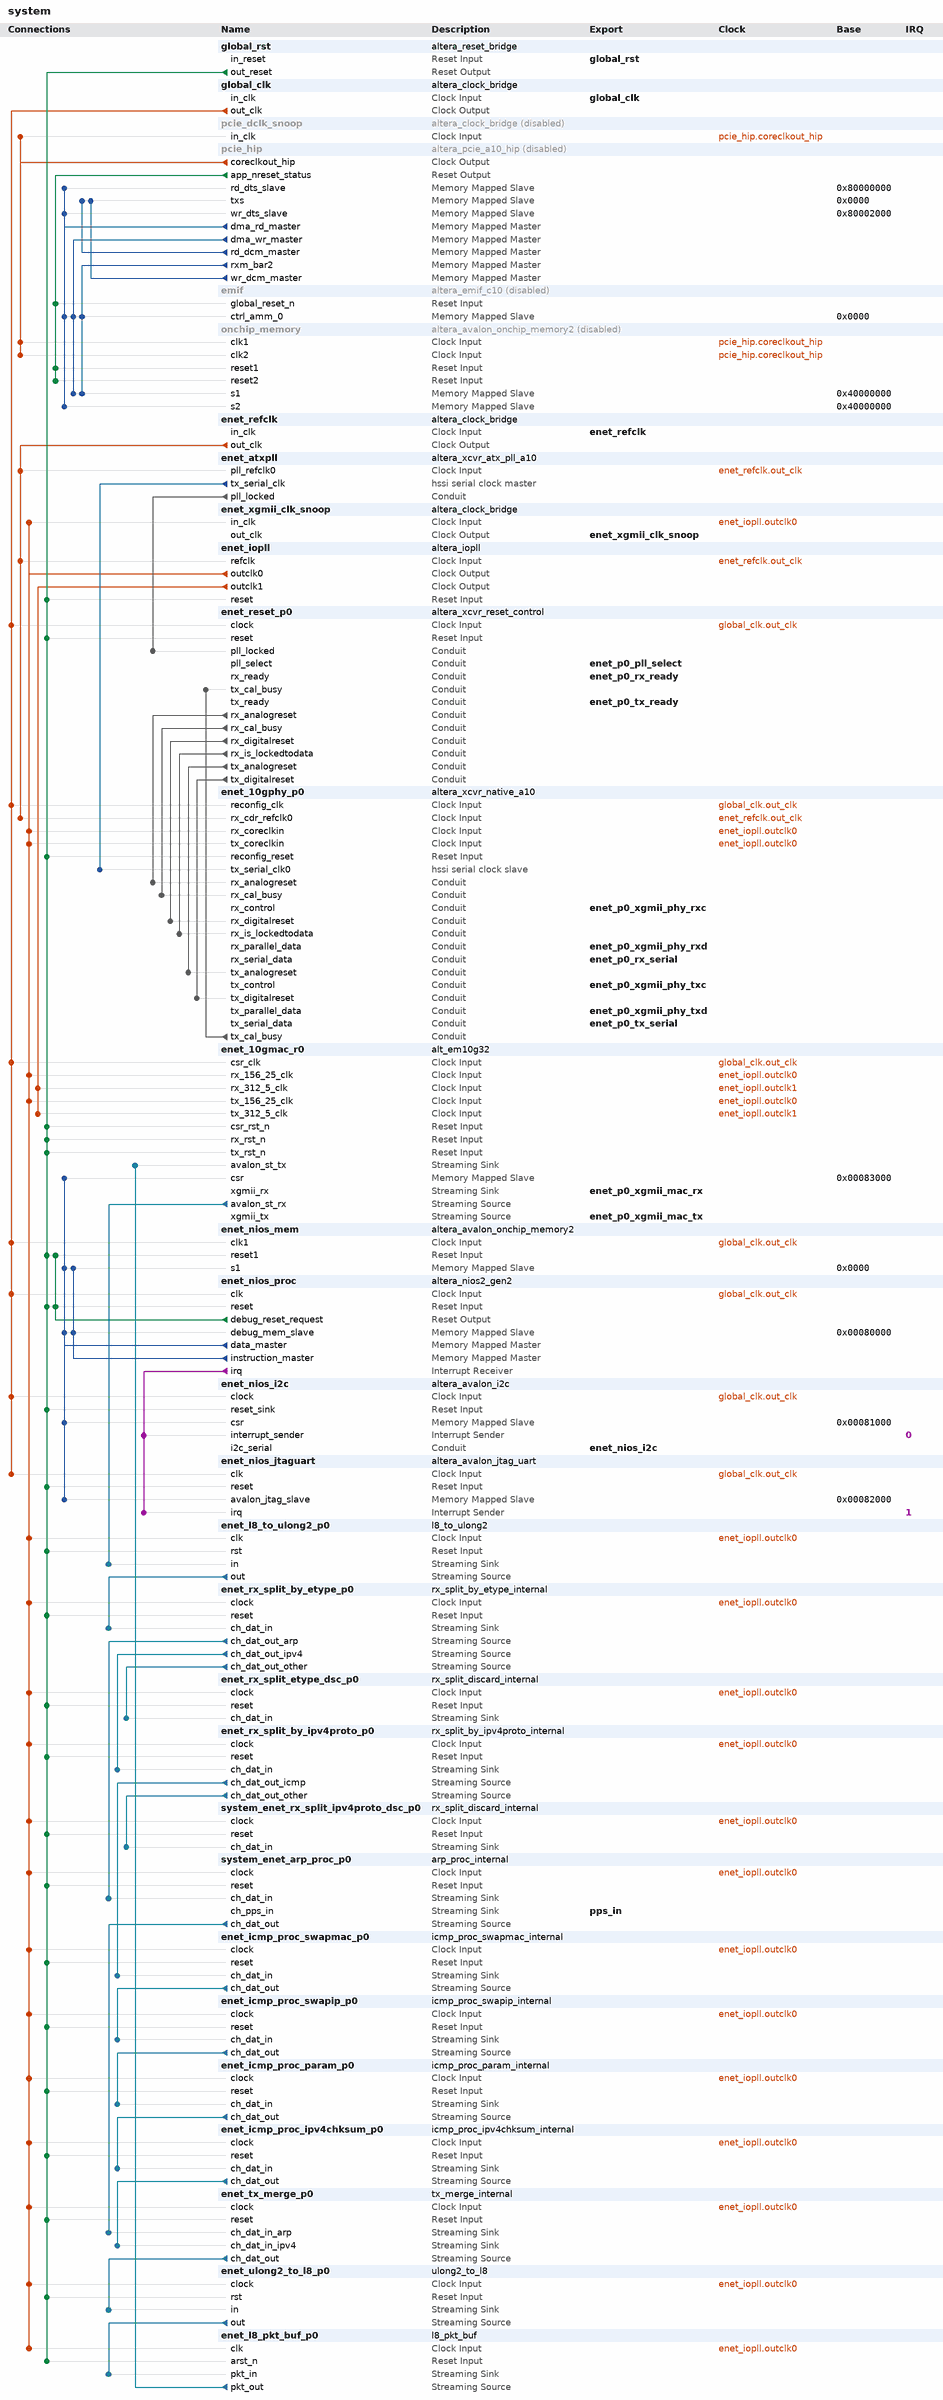
[diagram p0: system contents]
# Platform Designer (Qsys) system system, Cyclone 10 GX 10CX220YF780E5G
# Parameters at their usual value, and those the tool derives, are not listed.
package require -exact qsys 1.0
create_system system
set_project_property DEVICE_FAMILY {Cyclone 10 GX}
set_project_property DEVICE 10CX220YF780E5G

add_component global_rst ip/system_global_rst.ip altera_reset_bridge global_rst 19.2.0

add_component global_clk ip/system_global_clk.ip altera_clock_bridge global_clk 19.2.0

add_component pcie_dclk_snoop ip/system_pcie_dclk_snoop.ip altera_clock_bridge pcie_dclk_snoop 19.2.0
set_instance_property pcie_dclk_snoop ENABLED false

add_component pcie_hip ip/system_pcie_hip.ip altera_pcie_a10_hip pcie_hip 19.1
set_instance_property pcie_hip ENABLED false

add_component emif ip/system_emif.ip altera_emif_c10 emif 19.1.0
set_instance_property emif ENABLED false

add_component onchip_memory ip/system_onchip_memory.ip altera_avalon_onchip_memory2 onchip_memory 19.2.0
set_instance_property onchip_memory ENABLED false

add_component enet_refclk ip/system_enet_refclk.ip altera_clock_bridge enet_refclk 19.2.0

add_component enet_atxpll ip/system_enet_atxpll.ip altera_xcvr_atx_pll_a10 enet_atxpll 19.1

add_component enet_xgmii_clk_snoop ip/system_enet_xgmii_clk_snoop.ip altera_clock_bridge enet_xgmii_clk_snoop 19.2.0

add_component enet_iopll ip/system_enet_iopll.ip altera_iopll enet_iopll 19.3.0

add_component enet_reset_p0 ip/system_enet_reset_p0.ip altera_xcvr_reset_control enet_reset_p0 19.1

add_component enet_10gphy_p0 ip/system_enet_10gphy_p0.ip altera_xcvr_native_a10 enet_10gphy_p0 19.1

add_component enet_10gmac_r0 ip/system_enet_10gmac_p0.ip alt_em10g32 enet_10gmac_r0 19.3.0

add_component enet_nios_mem ip/system_enet_nios_mem.ip altera_avalon_onchip_memory2 enet_nios_mem 19.2.0

add_component enet_nios_proc ip/system_enet_nios_proc.ip altera_nios2_gen2 enet_nios_proc 19.1.0

add_component enet_nios_i2c ip/system_enet_nios_i2c.ip altera_avalon_i2c enet_nios_i2c 19.2.0

add_component enet_nios_jtaguart ip/system_enet_nios_jtaguart.ip altera_avalon_jtag_uart enet_nios_jtaguart 19.1.0

add_component enet_l8_to_ulong2_p0 ip/system_enet_l8_to_ulong2_p0.ip l8_to_ulong2 enet_l8_to_ulong2_p0 20.1

add_component enet_rx_split_by_etype_p0 ip/system_enet_rx_split_by_etype_p0.ip rx_split_by_etype_internal enet_rx_split_by_etype_p0 1.0

add_component enet_rx_split_etype_dsc_p0 ip/system_enet_rx_split_etype_dsc_p0.ip rx_split_discard_internal enet_rx_split_etype_dsc_p0 1.0

add_component enet_rx_split_by_ipv4proto_p0 ip/system_enet_rx_split_by_ipv4proto_p0.ip rx_split_by_ipv4proto_internal enet_rx_split_by_ipv4proto_p0 1.0

add_component system_enet_rx_split_ipv4proto_dsc_p0 ip/system_enet_rx_split_ipv4proto_dsc_p0.ip rx_split_discard_internal system_enet_rx_split_ipv4proto_dsc_p0 1.0

add_component system_enet_arp_proc_p0 ip/system_enet_arp_proc_p0.ip arp_proc_internal system_enet_arp_proc_p0 1.0

add_component enet_icmp_proc_swapmac_p0 ip/system_enet_icmp_proc_swapmac_p0.ip icmp_proc_swapmac_internal enet_icmp_proc_swapmac_p0 1.0

add_component enet_icmp_proc_swapip_p0 ip/system_enet_icmp_proc_swapip_p0.ip icmp_proc_swapip_internal enet_icmp_proc_swapip_p0 1.0

add_component enet_icmp_proc_param_p0 ip/system_enet_icmp_proc_param_p0.ip icmp_proc_param_internal enet_icmp_proc_param_p0 1.0

add_component enet_icmp_proc_ipv4chksum_p0 ip/system_enet_icmp_proc_ipv4chksum_p0.ip icmp_proc_ipv4chksum_internal enet_icmp_proc_ipv4chksum_p0 1.0

add_component enet_tx_merge_p0 ip/system_enet_tx_merge_p0.ip tx_merge_internal enet_tx_merge_p0 1.0

add_component enet_ulong2_to_l8_p0 ip/system_enet_ulong2_to_l8_p0.ip ulong2_to_l8 enet_ulong2_to_l8_p0 20.1

add_component enet_l8_pkt_buf_p0 ip/system_enet_l8_pkt_buf_p0.ip l8_pkt_buf enet_l8_pkt_buf_p0 1.0

# connections
add_connection enet_iopll.outclk0 enet_10gmac_r0.rx_156_25_clk clock
add_connection enet_iopll.outclk0 enet_10gmac_r0.tx_156_25_clk clock
add_connection enet_iopll.outclk0 enet_10gphy_p0.rx_coreclkin clock
add_connection enet_iopll.outclk0 enet_10gphy_p0.tx_coreclkin clock
add_connection enet_iopll.outclk0 enet_icmp_proc_ipv4chksum_p0.clock clock
add_connection enet_iopll.outclk0 enet_icmp_proc_param_p0.clock clock
add_connection enet_iopll.outclk0 enet_icmp_proc_swapip_p0.clock clock
add_connection enet_iopll.outclk0 enet_icmp_proc_swapmac_p0.clock clock
add_connection enet_iopll.outclk0 enet_l8_pkt_buf_p0.clk clock
add_connection enet_iopll.outclk0 enet_l8_to_ulong2_p0.clk clock
add_connection enet_iopll.outclk0 enet_rx_split_by_etype_p0.clock clock
add_connection enet_iopll.outclk0 enet_rx_split_by_ipv4proto_p0.clock clock
add_connection enet_iopll.outclk0 enet_rx_split_etype_dsc_p0.clock clock
add_connection enet_iopll.outclk0 enet_tx_merge_p0.clock clock
add_connection enet_iopll.outclk0 enet_ulong2_to_l8_p0.clock clock
add_connection enet_iopll.outclk0 enet_xgmii_clk_snoop.in_clk clock
add_connection enet_iopll.outclk0 system_enet_arp_proc_p0.clock clock
add_connection enet_iopll.outclk0 system_enet_rx_split_ipv4proto_dsc_p0.clock clock
add_connection enet_iopll.outclk1 enet_10gmac_r0.rx_312_5_clk clock
add_connection enet_iopll.outclk1 enet_10gmac_r0.tx_312_5_clk clock
add_connection enet_refclk.out_clk enet_10gphy_p0.rx_cdr_refclk0 clock
add_connection enet_refclk.out_clk enet_atxpll.pll_refclk0 clock
add_connection enet_refclk.out_clk enet_iopll.refclk clock
add_connection global_clk.out_clk enet_10gmac_r0.csr_clk clock
add_connection global_clk.out_clk enet_10gphy_p0.reconfig_clk clock
add_connection global_clk.out_clk enet_nios_i2c.clock clock
add_connection global_clk.out_clk enet_nios_jtaguart.clk clock
add_connection global_clk.out_clk enet_nios_mem.clk1 clock
add_connection global_clk.out_clk enet_nios_proc.clk clock
add_connection global_clk.out_clk enet_reset_p0.clock clock
add_connection pcie_hip.coreclkout_hip onchip_memory.clk1 clock
add_connection pcie_hip.coreclkout_hip onchip_memory.clk2 clock
add_connection pcie_hip.coreclkout_hip pcie_dclk_snoop.in_clk clock
add_connection enet_nios_proc.debug_reset_request enet_nios_mem.reset1 reset
add_connection enet_nios_proc.debug_reset_request enet_nios_proc.reset reset
add_connection global_rst.out_reset enet_10gmac_r0.csr_rst_n reset
add_connection global_rst.out_reset enet_10gmac_r0.rx_rst_n reset
add_connection global_rst.out_reset enet_10gmac_r0.tx_rst_n reset
add_connection global_rst.out_reset enet_10gphy_p0.reconfig_reset reset
add_connection global_rst.out_reset enet_icmp_proc_ipv4chksum_p0.reset reset
add_connection global_rst.out_reset enet_icmp_proc_param_p0.reset reset
add_connection global_rst.out_reset enet_icmp_proc_swapip_p0.reset reset
add_connection global_rst.out_reset enet_icmp_proc_swapmac_p0.reset reset
add_connection global_rst.out_reset enet_iopll.reset reset
add_connection global_rst.out_reset enet_l8_pkt_buf_p0.arst_n reset
add_connection global_rst.out_reset enet_l8_to_ulong2_p0.rst reset
add_connection global_rst.out_reset enet_nios_i2c.reset_sink reset
add_connection global_rst.out_reset enet_nios_jtaguart.reset reset
add_connection global_rst.out_reset enet_nios_mem.reset1 reset
add_connection global_rst.out_reset enet_nios_proc.reset reset
add_connection global_rst.out_reset enet_reset_p0.reset reset
add_connection global_rst.out_reset enet_rx_split_by_etype_p0.reset reset
add_connection global_rst.out_reset enet_rx_split_by_ipv4proto_p0.reset reset
add_connection global_rst.out_reset enet_rx_split_etype_dsc_p0.reset reset
add_connection global_rst.out_reset enet_tx_merge_p0.reset reset
add_connection global_rst.out_reset enet_ulong2_to_l8_p0.rst reset
add_connection global_rst.out_reset system_enet_arp_proc_p0.reset reset
add_connection global_rst.out_reset system_enet_rx_split_ipv4proto_dsc_p0.reset reset
add_connection pcie_hip.app_nreset_status emif.global_reset_n reset
add_connection pcie_hip.app_nreset_status onchip_memory.reset1 reset
add_connection pcie_hip.app_nreset_status onchip_memory.reset2 reset
add_connection enet_nios_proc.data_master enet_10gmac_r0.csr avalon
set_connection_parameter_value enet_nios_proc.data_master/enet_10gmac_r0.csr baseAddress 0x00083000
add_connection enet_nios_proc.data_master enet_nios_i2c.csr avalon
set_connection_parameter_value enet_nios_proc.data_master/enet_nios_i2c.csr baseAddress 0x00081000
add_connection enet_nios_proc.data_master enet_nios_jtaguart.avalon_jtag_slave avalon
set_connection_parameter_value enet_nios_proc.data_master/enet_nios_jtaguart.avalon_jtag_slave baseAddress 0x00082000
add_connection enet_nios_proc.data_master enet_nios_mem.s1 avalon
set_connection_parameter_value enet_nios_proc.data_master/enet_nios_mem.s1 baseAddress 0x0000
add_connection enet_nios_proc.data_master enet_nios_proc.debug_mem_slave avalon
set_connection_parameter_value enet_nios_proc.data_master/enet_nios_proc.debug_mem_slave baseAddress 0x00080000
add_connection enet_nios_proc.instruction_master enet_nios_mem.s1 avalon
set_connection_parameter_value enet_nios_proc.instruction_master/enet_nios_mem.s1 baseAddress 0x0000
add_connection enet_nios_proc.instruction_master enet_nios_proc.debug_mem_slave avalon
set_connection_parameter_value enet_nios_proc.instruction_master/enet_nios_proc.debug_mem_slave baseAddress 0x00080000
add_connection pcie_hip.dma_rd_master emif.ctrl_amm_0 avalon
set_connection_parameter_value pcie_hip.dma_rd_master/emif.ctrl_amm_0 baseAddress 0x0000
add_connection pcie_hip.dma_rd_master onchip_memory.s2 avalon
set_connection_parameter_value pcie_hip.dma_rd_master/onchip_memory.s2 baseAddress 0x40000000
add_connection pcie_hip.dma_rd_master pcie_hip.rd_dts_slave avalon
set_connection_parameter_value pcie_hip.dma_rd_master/pcie_hip.rd_dts_slave baseAddress 0x80000000
add_connection pcie_hip.dma_rd_master pcie_hip.wr_dts_slave avalon
set_connection_parameter_value pcie_hip.dma_rd_master/pcie_hip.wr_dts_slave baseAddress 0x80002000
add_connection pcie_hip.dma_wr_master emif.ctrl_amm_0 avalon
set_connection_parameter_value pcie_hip.dma_wr_master/emif.ctrl_amm_0 baseAddress 0x0000
add_connection pcie_hip.dma_wr_master onchip_memory.s1 avalon
set_connection_parameter_value pcie_hip.dma_wr_master/onchip_memory.s1 baseAddress 0x40000000
add_connection pcie_hip.rd_dcm_master pcie_hip.txs avalon
set_connection_parameter_value pcie_hip.rd_dcm_master/pcie_hip.txs baseAddress 0x0000
add_connection pcie_hip.rxm_bar2 emif.ctrl_amm_0 avalon
set_connection_parameter_value pcie_hip.rxm_bar2/emif.ctrl_amm_0 baseAddress 0x0000
add_connection pcie_hip.rxm_bar2 onchip_memory.s1 avalon
set_connection_parameter_value pcie_hip.rxm_bar2/onchip_memory.s1 baseAddress 0x40000000
add_connection pcie_hip.wr_dcm_master pcie_hip.txs avalon
set_connection_parameter_value pcie_hip.wr_dcm_master/pcie_hip.txs baseAddress 0x0000
add_connection enet_10gmac_r0.avalon_st_rx enet_l8_to_ulong2_p0.in avalon_streaming
add_connection enet_icmp_proc_ipv4chksum_p0.ch_dat_out enet_tx_merge_p0.ch_dat_in_ipv4 avalon_streaming
add_connection enet_icmp_proc_param_p0.ch_dat_out enet_icmp_proc_ipv4chksum_p0.ch_dat_in avalon_streaming
add_connection enet_icmp_proc_swapip_p0.ch_dat_out enet_icmp_proc_param_p0.ch_dat_in avalon_streaming
add_connection enet_icmp_proc_swapmac_p0.ch_dat_out enet_icmp_proc_swapip_p0.ch_dat_in avalon_streaming
add_connection enet_l8_pkt_buf_p0.pkt_out enet_10gmac_r0.avalon_st_tx avalon_streaming
add_connection enet_l8_to_ulong2_p0.out enet_rx_split_by_etype_p0.ch_dat_in avalon_streaming
add_connection enet_rx_split_by_etype_p0.ch_dat_out_arp system_enet_arp_proc_p0.ch_dat_in avalon_streaming
add_connection enet_rx_split_by_etype_p0.ch_dat_out_ipv4 enet_rx_split_by_ipv4proto_p0.ch_dat_in avalon_streaming
add_connection enet_rx_split_by_etype_p0.ch_dat_out_other enet_rx_split_etype_dsc_p0.ch_dat_in avalon_streaming
add_connection enet_rx_split_by_ipv4proto_p0.ch_dat_out_icmp enet_icmp_proc_swapmac_p0.ch_dat_in avalon_streaming
add_connection enet_rx_split_by_ipv4proto_p0.ch_dat_out_other system_enet_rx_split_ipv4proto_dsc_p0.ch_dat_in avalon_streaming
add_connection enet_tx_merge_p0.ch_dat_out enet_ulong2_to_l8_p0.in avalon_streaming
add_connection enet_ulong2_to_l8_p0.out enet_l8_pkt_buf_p0.pkt_in avalon_streaming
add_connection system_enet_arp_proc_p0.ch_dat_out enet_tx_merge_p0.ch_dat_in_arp avalon_streaming
add_connection enet_10gphy_p0.tx_cal_busy enet_reset_p0.tx_cal_busy conduit
add_connection enet_atxpll.pll_locked enet_reset_p0.pll_locked conduit
add_connection enet_reset_p0.rx_analogreset enet_10gphy_p0.rx_analogreset conduit
add_connection enet_reset_p0.rx_cal_busy enet_10gphy_p0.rx_cal_busy conduit
add_connection enet_reset_p0.rx_digitalreset enet_10gphy_p0.rx_digitalreset conduit
add_connection enet_reset_p0.rx_is_lockedtodata enet_10gphy_p0.rx_is_lockedtodata conduit
add_connection enet_reset_p0.tx_analogreset enet_10gphy_p0.tx_analogreset conduit
add_connection enet_reset_p0.tx_digitalreset enet_10gphy_p0.tx_digitalreset conduit
add_connection enet_atxpll.tx_serial_clk enet_10gphy_p0.tx_serial_clk0 hssi_serial_clock
add_connection enet_nios_proc.irq enet_nios_i2c.interrupt_sender interrupt
set_connection_parameter_value enet_nios_proc.irq/enet_nios_i2c.interrupt_sender irqNumber 0
add_connection enet_nios_proc.irq enet_nios_jtaguart.irq interrupt
set_connection_parameter_value enet_nios_proc.irq/enet_nios_jtaguart.irq irqNumber 1

# exported interfaces
add_interface enet_nios_i2c conduit end
set_interface_property enet_nios_i2c EXPORT_OF enet_nios_i2c.i2c_serial
add_interface enet_p0_pll_select conduit end
set_interface_property enet_p0_pll_select EXPORT_OF enet_reset_p0.pll_select
add_interface enet_p0_rx_ready conduit end
set_interface_property enet_p0_rx_ready EXPORT_OF enet_reset_p0.rx_ready
add_interface enet_p0_rx_serial conduit end
set_interface_property enet_p0_rx_serial EXPORT_OF enet_10gphy_p0.rx_serial_data
add_interface enet_p0_tx_ready conduit end
set_interface_property enet_p0_tx_ready EXPORT_OF enet_reset_p0.tx_ready
add_interface enet_p0_tx_serial conduit end
set_interface_property enet_p0_tx_serial EXPORT_OF enet_10gphy_p0.tx_serial_data
add_interface enet_p0_xgmii_mac_rx avalon_streaming sink
set_interface_property enet_p0_xgmii_mac_rx EXPORT_OF enet_10gmac_r0.xgmii_rx
add_interface enet_p0_xgmii_mac_tx avalon_streaming source
set_interface_property enet_p0_xgmii_mac_tx EXPORT_OF enet_10gmac_r0.xgmii_tx
add_interface enet_p0_xgmii_phy_rxc conduit end
set_interface_property enet_p0_xgmii_phy_rxc EXPORT_OF enet_10gphy_p0.rx_control
add_interface enet_p0_xgmii_phy_rxd conduit end
set_interface_property enet_p0_xgmii_phy_rxd EXPORT_OF enet_10gphy_p0.rx_parallel_data
add_interface enet_p0_xgmii_phy_txc conduit end
set_interface_property enet_p0_xgmii_phy_txc EXPORT_OF enet_10gphy_p0.tx_control
add_interface enet_p0_xgmii_phy_txd conduit end
set_interface_property enet_p0_xgmii_phy_txd EXPORT_OF enet_10gphy_p0.tx_parallel_data
add_interface enet_refclk clock sink
set_interface_property enet_refclk EXPORT_OF enet_refclk.in_clk
add_interface enet_xgmii_clk_snoop clock source
set_interface_property enet_xgmii_clk_snoop EXPORT_OF enet_xgmii_clk_snoop.out_clk
add_interface global_clk clock sink
set_interface_property global_clk EXPORT_OF global_clk.in_clk
add_interface global_rst reset sink
set_interface_property global_rst EXPORT_OF global_rst.in_reset
add_interface pps_in avalon_streaming sink
set_interface_property pps_in EXPORT_OF system_enet_arp_proc_p0.ch_pps_in

save_system system.qsys
